# EAGLE design sensors (EAGLE 7.7.0)
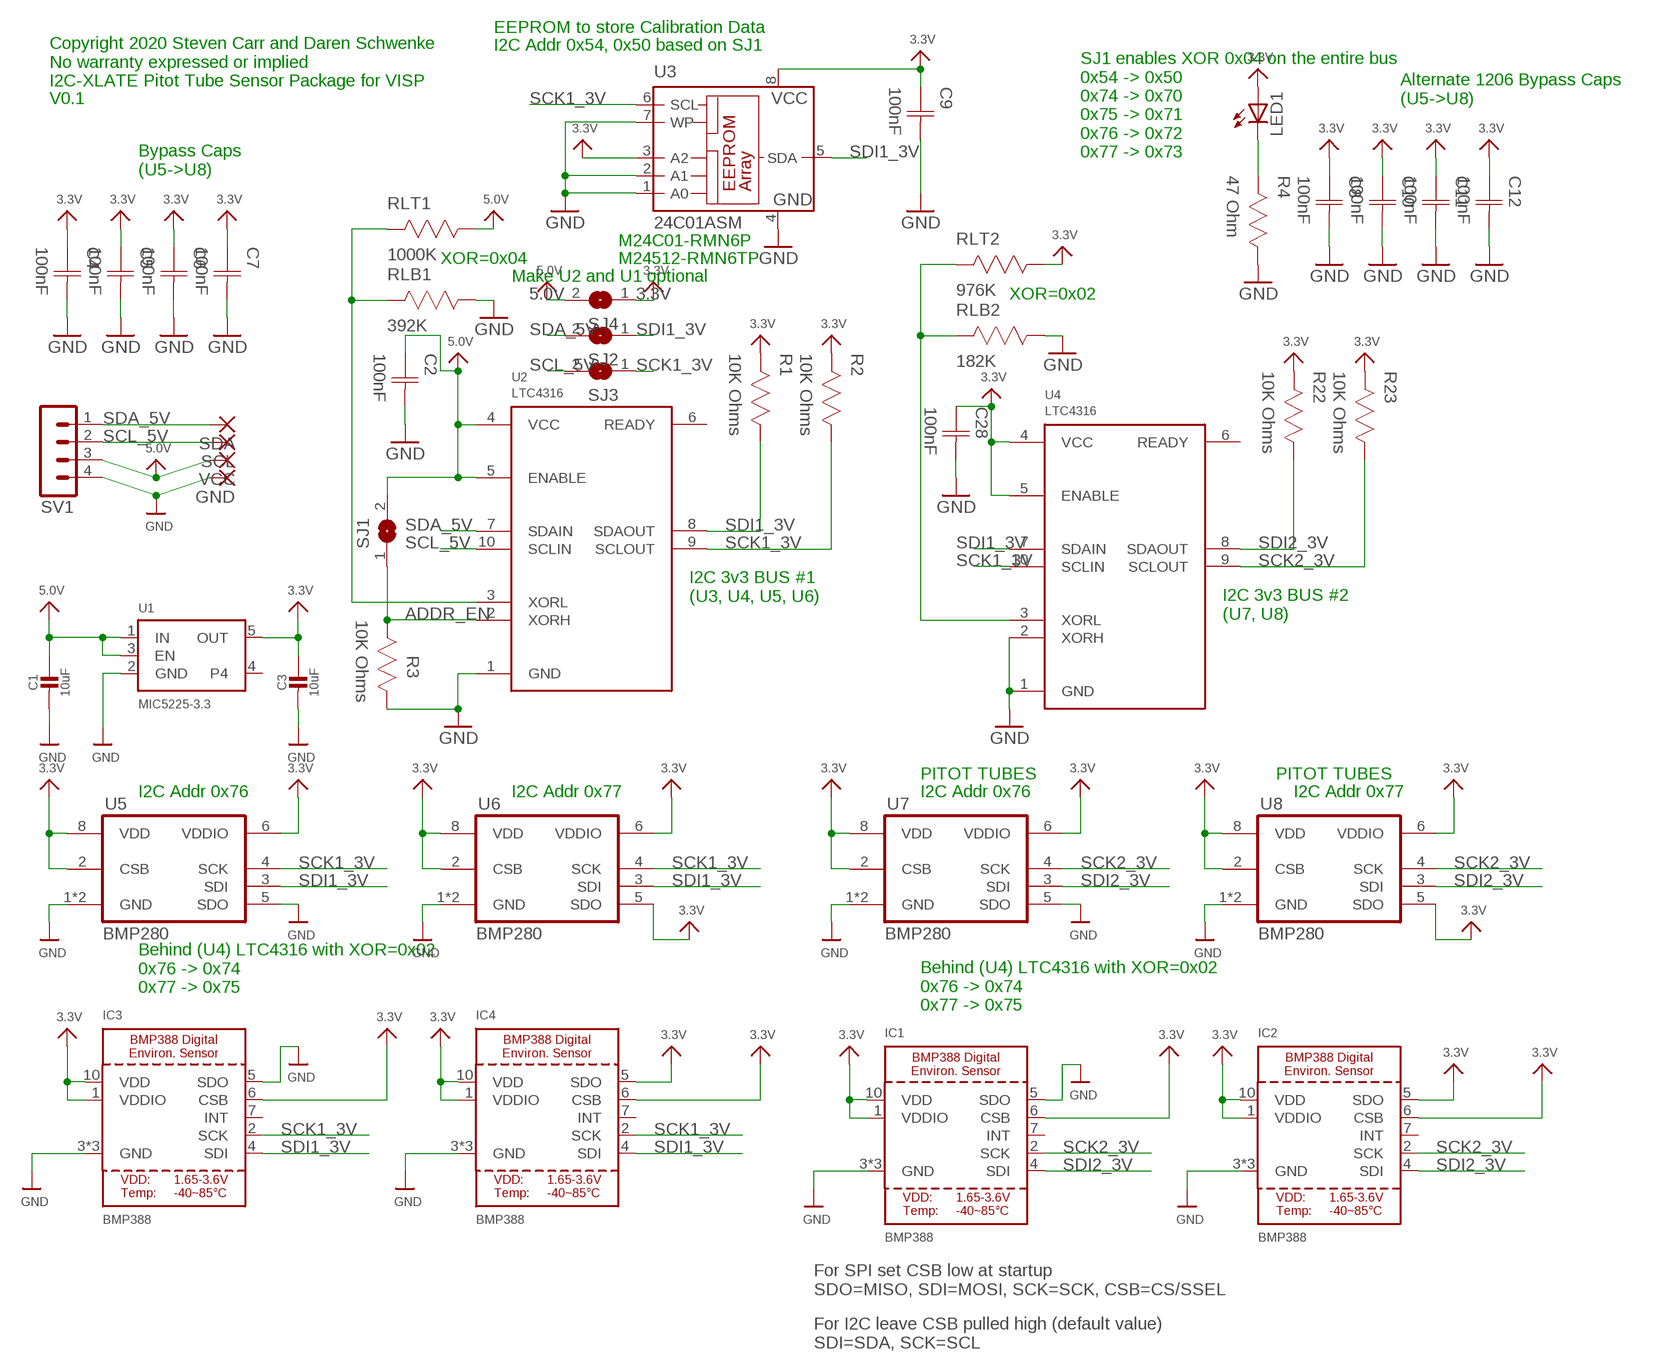
[diagram p0: schematic, sheet 1]

## Parts
C1  10uF  CAP_CERAMIC0603_NO  [0603-NO]
C2  100nF  CAPACITOR-0603  [CAP0603]
C3  10uF  CAP_CERAMIC0603_NO  [0603-NO]
C4  100nF  CAPACITOR-0402  [CAP0402]
C5  100nF  CAPACITOR-0402  [CAP0402]
C6  100nF  CAPACITOR-0402  [CAP0402]
C7  100nF  CAPACITOR-0402  [CAP0402]
C8  100nF  CAPACITOR-1206  [CAP1206]
C9  100nF  CAPACITOR-0603  [CAP0603]
C10  100nF  CAPACITOR-1206  [CAP1206]
C11  100nF  CAPACITOR-1206  [CAP1206]
C12  100nF  CAPACITOR-1206  [CAP1206]
C28  100nF  CAPACITOR-0603  [CAP0603]
GND  SMD2  [SMD1,27-2,54]
IC1  BMP388  [BMP388]
IC2  BMP388  [BMP388]
IC3  BMP388  [BMP388]
IC4  BMP388  [BMP388]
LED1  LEDCHIP-LED0603  [CHIP-LED0603]
R1  10K Ohms  RESISTOR-0603  [RES0603]
R2  10K Ohms  RESISTOR-0603  [RES0603]
R3  10K Ohms  RESISTOR-0603  [RES0603]
R4  47 Ohm  RESISTOR-0603  [RES0603]
R22  10K Ohms  RESISTOR-0603  [RES0603]
R23  10K Ohms  RESISTOR-0603  [RES0603]
RLB1  392K  RESISTOR-0603  [RES0603]
RLB2  182K  RESISTOR-0603  [RES0603]
RLT1  1000K  RESISTOR-0603  [RES0603]
RLT2  976K  RESISTOR-0603  [RES0603]
SCL  SMD2  [SMD1,27-2,54]
SDA  SMD2  [SMD1,27-2,54]
SJ1  SJ  [SJ]
SJ2  SJ  [SJ]
SJ3  SJ  [SJ]
SJ4  SJ  [SJ]
SV1  MA04-1  [MA04-1]
U1  MIC5225-3.3  VREG_SOT23-5  [SOT23-5]
U2  LTC4316  [MSOP10]
U3  24C01ASM  [SO-08M]
U4  LTC4316  [MSOP10]
U5  BMP280  [BMP280]
U6  BMP280  [BMP280]
U7  BMP280  [BMP280]
U8  BMP280  [BMP280]
VCC  SMD2  [SMD1,27-2,54]

## Nets
3.3V: C3.1 C4.1(C1) C5.1(C1) C6.1(C1) C7.1(C1) C8.1(C1) C9.1(C1) C10.1(C1) C11.1(C1) C12.1(C1) C28.1(C1) IC1.1(VDDIO) IC1.6(CSB) IC1.10(VDD) IC2.1(VDDIO) IC2.5(SDO) IC2.6(CSB) IC2.10(VDD) IC3.1(VDDIO) IC3.6(CSB) IC3.10(VDD) IC4.1(VDDIO) IC4.5(SDO) IC4.6(CSB) IC4.10(VDD) LED1.A R1.2 R2.2 R22.2 R23.2 RLT2.1 SJ4.1 U1.5(OUT) U3.3(A2) U3.8(VCC) U4.4(VCC) U4.5(ENABLE) U5.2(CSB) U5.6(VDDIO) U5.8(VDD) U6.2(CSB) U6.5(SDO) U6.6(VDDIO) U6.8(VDD) U7.2(CSB) U7.6(VDDIO) U7.8(VDD) U8.2(CSB) U8.5(SDO) U8.6(VDDIO) U8.8(VDD)
5.0V: C1.1 C2.1(C1) RLT1.1 SJ1.2 SJ4.2 SV1.3 U1.1(IN) U1.3(EN) U2.4(VCC) U2.5(ENABLE) VCC.1(P)
ADDR_EN: R3.2 SJ1.1 U2.2(XORH)
GND: C1.2 C2.2(C2) C3.2 C4.2(C2) C5.2(C2) C6.2(C2) C7.2(C2) C8.2(C2) C9.2(C2) C10.2(C2) C11.2(C2) C12.2(C2) C28.2(C2) GND.1(P) IC1.3(GND) IC1.5(SDO) IC1.8(GND) IC1.9(GND) IC2.3(GND) IC2.8(GND) IC2.9(GND) IC3.3(GND) IC3.5(SDO) IC3.8(GND) IC3.9(GND) IC4.3(GND) IC4.8(GND) IC4.9(GND) R3.1 R4.1 RLB1.1 RLB2.1 SV1.4 U1.2(GND) U2.1(GND) U3.1(A0) U3.2(A1) U3.4(GND) U3.7(WP) U4.1(GND) U4.2(XORH) U5.1(GND) U5.5(SDO) U5.7(GND) U6.1(GND) U6.7(GND) U7.1(GND) U7.5(SDO) U7.7(GND) U8.1(GND) U8.7(GND)
LED: LED1.C R4.2
SCK1_3V: IC3.2(SCK) IC4.2(SCK) R2.1 SJ3.1 U2.9(SCLOUT) U3.6(SCL) U4.10(SCLIN) U5.4(SCK) U6.4(SCK)
SCK2_3V: IC1.2(SCK) IC2.2(SCK) R23.1 U4.9(SCLOUT) U7.4(SCK) U8.4(SCK)
SCL_5V: SCL.1(P) SJ3.2 SV1.2 U2.10(SCLIN)
SDA_5V: SDA.1(P) SJ2.2 SV1.1 U2.7(SDAIN)
SDI1_3V: IC3.4(SDI) IC4.4(SDI) R1.1 SJ2.1 U2.8(SDAOUT) U3.5(SDA) U4.7(SDAIN) U5.3(SDI) U6.3(SDI)
SDI2_3V: IC1.4(SDI) IC2.4(SDI) R22.1 U4.8(SDAOUT) U7.3(SDI) U8.3(SDI)
XORL1: RLB1.2 RLT1.2 U2.3(XORL)
XORL2: RLB2.2 RLT2.2 U4.3(XORL)
Unconnected: IC1.7(INT) IC2.7(INT) IC3.7(INT) IC4.7(INT) U1.4 U2.6(READY) U4.6(READY)

## Notes on the sheet
- EEPROM to store Calibration Data
- I2C Addr 0x54, 0x50 based on SJ1
- Copyright 2020 Steven Carr and Daren Schwenke
  No warranty expressed or implied
  I2C-XLATE Pitot Tube Sensor Package for VISP
- V0.1
- Alternate 1206 Bypass Caps
  (U5->U8)
- SJ1 enables XOR 0x04 on the entire bus
  0x54 -> 0x50
  0x74 -> 0x70
  0x75 -> 0x71
  0x76 -> 0x72
  0x77 -> 0x73
- Bypass Caps
  (U5->U8)
- M24C01-RMN6P
- XOR=0x04 | M24512-RMN6TP
- Make U2 and U1 optional
- XOR=0x02
- I2C 3v3 BUS #1
  (U3, U4, U5, U6)
- I2C 3v3 BUS #2
  (U7, U8)
- PITOT TUBES | PITOT TUBES
- I2C Addr 0x76 | I2C Addr 0x77 | I2C Addr 0x76 | I2C Addr 0x77
- Behind (U4) LTC4316 with XOR=0x02
  0x76 -> 0x74
  0x77 -> 0x75
- Behind (U4) LTC4316 with XOR=0x02
  0x76 -> 0x74
  0x77 -> 0x75
- For SPI set CSB low at startup
  SDO=MISO, SDI=MOSI, SCK=SCK, CSB=CS/SSEL
- For I2C leave CSB pulled high (default value)
  SDI=SDA, SCK=SCL

## Library data of the parts
C1 C3 = microbuilder:CAP_CERAMIC: Ceramic Capacitors For new designs, use the packages preceded by an '_' character since they are more reliable: The following footprints should be used on most boards: _0402 - Standard footprint for regular board layouts _0603 - Standard footprint for regular board layouts _0805 - Standard footprint for regular board layouts _1206 - Standard footprint for regular board layouts For extremely tight-pitch boards where space is at a premium, the following 'micro-pitch' footprints can be used (smaller pads, no silkscreen outline, etc.): _0402MP - Micro-pitch footprint for very dense/compact boards _0603MP - Micro-pitch footprint for very dense/compact boards _0805MP - Micro-pitch footprint for very dense/compact boards _1206MP - Micro-pitch footprint for very dense/compact boards; MPN: C1608X5R1A106M080AC
C2 C9 C28 = Capacitor:CAPACITOR; MPN: CL10B104KB8NNNC
C4-C7 = Capacitor:CAPACITOR; MPN: CL10F104ZO8NNNC
C8 C10-C12 = Capacitor:CAPACITOR; MPN: C1206C104K5RAC7800
GND SCL SDA VCC = wirepad:SMD2: SMD PAD
IC1-IC4 = microbuilder:BMP388; MPN: BMP388
LED1 = led:LED: LED OSRAM: - CHIPLED LG R971, LG N971, LY N971, LG Q971, LY Q971, LO R971, LY R971 LH N974, LH R974 LS Q976, LO Q976, LY Q976 LO Q996 - Hyper CHIPLED LW Q18S LB Q993, LB Q99A, LB R99A - SideLED LS A670, LO A670, LY A670, LG A670, LP A670 LB A673, LV A673, LT A673, LW A673 LH A674 LY A675 LS A676, LA A676, LO A676, LY A676, LW A676 LS A679, LY A679, LG A679 - Hyper Micro SIDELED® LS Y876, LA Y876, LO Y876, LY Y876 LT Y87S - SmartLED LW L88C, LW L88S LB L89C, LB L89S, LG L890 LS L89K, LO L89K, LY L89K LS L896, LA L896, LO L896, LY L896 - TOPLED LS T670, LO T670, LY T670, LG T670, LP T670 LSG T670, LSP T670, LSY T670, LOP T670, LYG T670 LG T671, LOG T671, LSG T671 LB T673, LV T673, LT T673, LW T673 LH T674 LS T676, LA T676, LO T676, LY T676, LB T676, LH T676, LSB T676, LW T676 LB T67C, LV T67C, LT T67C, LS T67K, LO T67K, LY T67K, LW E67C LS E67B, LA E67B, LO E67B, LY E67B, LB E67C, LV E67C, LT E67C LW T67C LS T679, LY T679, LG T679 LS T770, LO T770, LY T770, LG T770, LP T770 LB T773, LV T773, LT T773, LW T773 LH T774 LS E675, LA E675, LY E675, LS T675 LS T776, LA T776, LO T776, LY T776, LB T776 LHGB T686 LT T68C, LB T68C - Hyper Mini TOPLED® LB M676 - Mini TOPLED Santana® LG M470 LS M47K, LO M47K, LY M47K Source: http://www.osram.convergy.de LUXEON: - LUMILED® LXK2-PW12-R00, LXK2-PW12-S00, LXK2-PW14-U00, LXK2-PW14-V00 LXK2-PM12-R00, LXK2-PM12-S00, LXK2-PM14-U00 LXK2-PE12-Q00, LXK2-PE12-R00, LXK2-PE12-S00, LXK2-PE14-T00, LXK2-PE14-U00 LXK2-PB12-K00, LXK2-PB12-L00, LXK2-PB12-M00, LXK2-PB14-N00, LXK2-PB14-P00, LXK2-PB14-Q00 LXK2-PR12-L00, LXK2-PR12-M00, LXK2-PR14-Q00, LXK2-PR14-R00 LXK2-PD12-Q00, LXK2-PD12-R00, LXK2-PD12-S00 LXK2-PH12-R00, LXK2-PH12-S00 LXK2-PL12-P00, LXK2-PL12-Q00, LXK2-PL12-R00 Source: www.luxeon.com KINGBRIGHT: KA-3528ASYC Source: www.kingbright.com; MPN: SML-D12P8WT86
R1 R2 R22 R23 RLT1 = Resistor:RESISTOR; MPN: CRCW060310K0FKEAC
R3 = Resistor:RESISTOR; MPN: CL10B104KB8NNNC
R4 = Resistor:RESISTOR; MPN: RC0603FR-0747RL
RLB1 = Resistor:RESISTOR; MPN: RC0603FR-07392KL
RLB2 = Resistor:RESISTOR; MPN: RC0603FR-07182KL
RLT2 = Resistor:RESISTOR; MPN: RC0603FR-07976KL
SJ1-SJ4 = jumper:SJ: SMD solder JUMPER
SV1 = con-lstb:MA04-1: PIN HEADER; OC_FARNELL: unknown; OC_NEWARK: unknown
U1 = microbuilder:VREG_SOT23-5: SOT23-5 Fixed Voltage Regulators Part Current Out V Out V In V Dropout θJA (°C/W) TJ (°C) Digikey Part No. ADP121 150mA 3.3V 3.4-5.5V 0.09V @ 150mA -- -- ADP121-AUJZ33R7CT-ND ADP121 150mA 3.0V 3.1-5.5V 0.09V @ 150mA -- -- ADP121-AUJZ30R7CT-ND ADP122 300mA 3.3V 3.4-5.5V 0.085V @ 300mA -- -- ADP122AUJZ-3.3-R7CT-ND ADP1712 300mA 3.3V 3.5-5.5V 0.17V @ 300mA -- -- ADP1712AUJZ-3.3-R7TR-ND AP7311 (Low Cost) 150mA 3.3V 3.5-6V 0.15V @ 150mA -- -- AP7311-33WG-7DICT-ND LD39015M18R 150mA 1.8V 1.9V-5.5V 0.08V @ 100mA -- -- 497-6977-1-ND LP2985A-33DBVR 150mA 3.3V 3.3-16V 0.28V @ 150mA 206 150 296-18479-1-ND MCP1824T-3302E/OT 300mA 3.3V 3.5V-6V 0.2V @ 300mA -- -- MCP1824T-3302E/OTCT-ND MIC5205-2.5YM5 TR 150mA 2.5V 2.7-16V 0.165V @ 150mA -- -- 576-1257-2-ND MIC5205-3.0YM5 TR 150mA 3.0V 3.2V-16V 0.165V @ 150mA -- -- 576-1258-2-ND MIC5205-3.3YM5 TR 150mA 3.3V 3.5V-16V 0.165V @ 150mA -- -- 576-1259-2-ND TPS780330220 150mA 3.3V+2.2V 3.6-5.5V 250mV Max -- -- 296-23332-1-ND TDA3663/N1,135 100mA 3.3V 3.5-45V 0.18V @ 50mA -- -- 568-5343-1-ND Max operating temp can be calculated using θJA, TJ (max junction temperature), and power in watts. Set the "Maximum Ambient Temperature" until it reaches TJ ("Max Junction Temperature"), which is the absolute limit for safe use of the regulator: Heat Sink Temperature Calculator <http://www.daycounter.com/Calculators/Heat-Sink-Temperature-Calculator.phtml> For example, With 12V source into a 3.3V LP2985 and a 30mA load, we are dissipating (12V-3.3V) * 0.03A = 0.261W. With a θJA of 206 °C/W, a TJ of 150°C, and 261mW we can safely use the chip without a heat sink up to 75°C (=147.1°C Junction Temperature).; MPN: MIC5225-3.3YM5-TR
U2 U4 = Analog Devices:LTC4316; MPN: LTC4316IMS#PBF
U3 = microchip:24*: Serial EEPROM I2C; MF: MICROCHIP; MPN: M24C01-RMN6P
U5-U8 = bosch-bmp280:BMP280: The BMP280 is an absolute barometric pressure sensor especially designed for mobile applications. The sensor module is housed in an extremely compact 8-pin metal-lid LGA package with a footprint of only 2.0 × 2.5 mm2 and 0.95 mm package height. Its small dimensions and its low power consumption of 2.7 μA @1Hz allow the implementation in battery driven devices such as mobile phones, GPS modules or watches. The library has been designed by Richard Magdycz <https://www.facebook.com/groups/eaglecadsoftUK>; MPN: BMP280

## Board
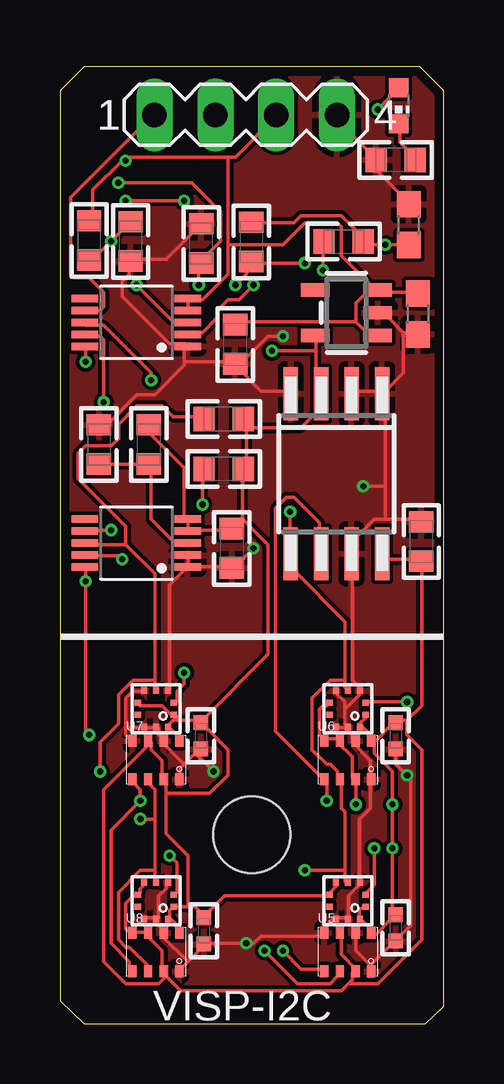
[diagram p1: board, top side]
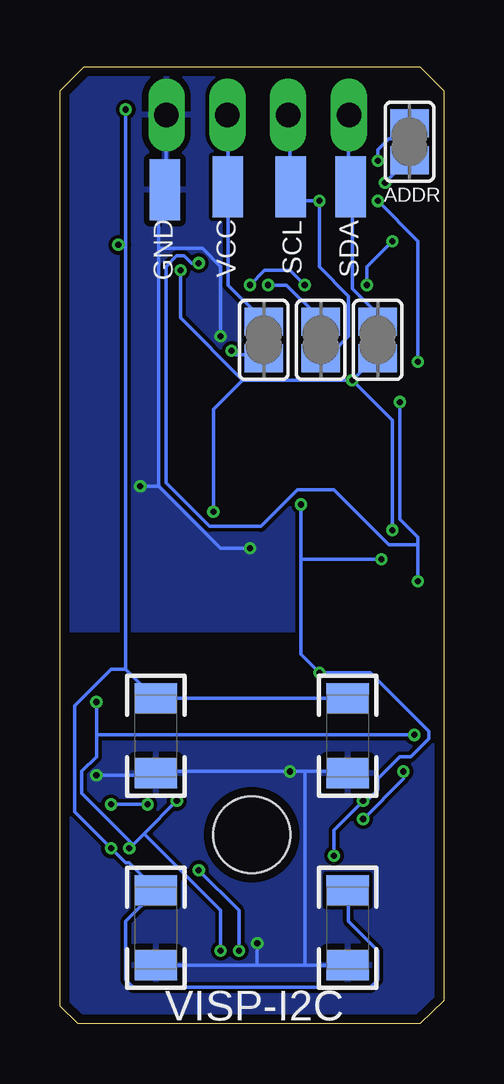
[diagram p2: board, bottom side, seen from below]

Size 16 x 39.88 mm. Coordinates in mm from the lower left corner, seen from the top.
Outline: 1,39.88 0,38.88 0,0.95 1,0 15.23,0 16,0.72 16,38.88 15,39.88 1,39.88
Copper layers (1*16): Top 0.035559375mm / dielectric 1.6mm / Bottom 0.035559375mm
Design rules "oshpark-2layer": minimum track width 6mil, minimum drill 10mil, track to track 6mil, track to pad 6mil, pad to pad 6mil, via to via 6mil, smd to smd 6mil, copper to edge 15mil, drill to drill 6mil, minimum pad ring 5mil, minimum via ring 5mil, stop-mask expansion 2.5mil, vias tented up to drill 0mil, thermal gap 10mil
Holes 3.2 mm at 8,7.88
vRestrict: area 2.8,2.8 to 5.2,5.2; area 10.8,2.8 to 13.2,5.2; area 2.8,10.8 to 5.2,13.2; area 10.8,10.8 to 13.2,13.2

### Footprints (pad centres in the part's own frame; a part is rotated, then mirrored left to right if it is on the bottom)
0603-NO = smd 1.1 x 1: 1 -0.85,0; 2 0.85,0
CAP0603 = smd 0.889 x 1.016: 1 -0.819,0; 2 0.819,0
CAP0402 = smd 0.6 x 0.6: 1 -0.55,0; 2 0.55,0
CAP1206 = smd 1.27 x 1.778: 1 -1.549,0; 2 1.549,0
SMD1,27-2,54 = smd 1.27 x 2.54: 1 0,0
BMP388 = smd 0.25 x 0.275: 1 0.25,0.75; 2 -0.25,0.75; 6 -0.25,-0.75; 7 0.25,-0.75 | smd 0.275 x 0.25: 3 -0.762,0.5; 4 -0.762,0; 5 -0.762,-0.5; 8 0.762,-0.5; 9 0.762,0; 10 0.762,0.5
CHIP-LED0603 = smd 0.8 x 0.8: A 0,-0.75; C 0,0.75
RES0603 = smd 0.889 x 1.016: 1 -0.819,0; 2 0.819,0
SJ = smd 1.168 x 1.6: 1 -0.762,0; 2 0.762,0
MA04-1 = drill 1.016 long: 1 -3.81,0; 2 -1.27,0; 3 1.27,0; 4 3.81,0
SOT23-5 = smd 0.55 x 1.2: 1 -0.95,-1.3; 2 0,-1.3; 3 0.95,-1.3; 4 0.95,1.3; 5 -0.95,1.3
MSOP10 = smd 0.3 x 1.1: 1 -1,-2.14; 2 -0.5,-2.14; 3 0,-2.14; 4 0.5,-2.14; 5 1,-2.14; 6 1,2.14; 7 0.5,2.14; 8 0,2.14; 9 -0.5,2.14; 10 -1,2.14
SO-08M = smd 0.6 x 2.2: 1 -1.905,-3.33; 2 -0.635,-3.33; 3 0.635,-3.33; 4 1.905,-3.33; 5 1.905,3.33; 6 0.635,3.33; 7 -0.635,3.33; 8 -1.905,3.33
BMP280 = smd 0.35 x 0.5: 1 0.975,-0.8; 2 0.325,-0.8; 3 -0.325,-0.8; 4 -0.975,-0.8; 5 -0.975,0.8; 6 -0.325,0.8; 7 0.325,0.8; 8 0.975,0.8

### Placement (x,y rotation side)
C1  14.93,29.57 270 top
C2  7.31,28.32 270 top
C3  14.54,33.3 90 top
C4  5.88,12 270 top
C5  14,4 270 top
C6  6,3.88 270 top
C7  14,12 270 top
C8  4,4 270 bottom
C9  15.07,20.09 90 top
C10  4,12 270 bottom
C11  12,4 270 bottom
C12  12,12 270 bottom
C28  7.17,19.82 270 top
GND  11.62,34.75 0 bottom
IC1  4,13.12 270 top
IC2  4,5.12 270 top
IC3  12,13.12 270 top
IC4  12,5.12 270 top
LED1  14.12,38.25 180 top
R1  11.83,32.59 0 top
R2  7.99,32.58 90 top
R3  5.89,32.52 270 top
R4  14,36 0 top
R22  6.83,25.2 0 top
R23  6.83,23.12 0 top
RLB1  2.95,32.6 90 top
RLB2  1.63,24.14 270 top
RLT1  1.22,32.65 270 top
RLT2  3.71,24.14 270 top
SCL  6.38,34.88 0 bottom
SDA  3.88,34.88 0 bottom
SJ1  1.42,36.76 90 bottom
SJ2  2.75,28.5 90 bottom
SJ3  5.12,28.5 270 bottom
SJ4  7.5,28.5 90 bottom
SV1  7.75,37.88 0 top
U1  11.95,29.63 90 top
U2  3.19,29.23 90 top
U3  11.53,22.92 180 top
U4  3.19,20.04 90 top
U5  12,3 0 top
U6  12,11 0 top
U7  4,11 0 top
U8  4,3 0 top
VCC  9,34.88 0 bottom

### Tracks (layer width: path | path; a pad name or v marks a point on that pad's centre or on a via)
3.3V  (via drill 0.25)
  Top 0.152: U3.8 13.56,19.51 13.72,19.36 14.94,19.36 C9.1 15.09,19.2 15.09,13.26 14.48,12.65 | IC3.6 11.12,13.26 10.97,13.26 10.82,13.11 10.82,12.04 10.97,11.89 U6.5 11.12,11.89 11.58,11.89 U6.6 11.58,11.73 12.19,11.12 12.19,10.21 U6.2 12.34,10.06 v12.34,9.14 | 12.5,4.42 12.5,4.72 12.65,4.88 IC4.1 | 12.5,4.42 12.95,3.96 12.95,3.81 U5.8 13.11,3.66 13.87,4.42 C5.1 13.87,4.57 v13.87,7.32 v13.87,9.14 13.87,10.52 13.11,11.28 13.11,11.73 | 12.5,4.42 IC4.10 | 12.5,12.5 12.8,12.8 IC3.1 | 12.5,12.5 12.95,12.04 12.95,11.89 U6.8 13.11,11.73 | 12.5,12.5 IC3.10 | 13.11,11.73 13.87,12.5 C7.1 14.02,12.65 14.48,12.65 | 10.67,28.04 10.67,26.52 10.82,26.36 U3.3 10.82,26.21 10.82,25.6 10.06,24.84 7.77,24.84 | 10.67,28.04 10.67,28.65 U1.5 | 10.67,28.04 v8.84,28.04 | 7.77,24.84 7.77,25.15 R22.2 7.77,24.84 | 7.77,24.84 7.77,23.16 R23.2 7.62,23.01 7.62,21.03 | 5.33,20.57 7.16,20.57 C28.1 | RLT2.1 3.81,24.84 3.81,24.54 5.18,23.16 5.18,21.18 U4.5 5.33,20.57 | 5.33,20.57 U4.4 | 7.62,21.03 7.32,20.73 C28.1 | U5.6 11.73,3.66 11.73,2.9 12.34,2.29 U5.2 12.19,2.13 12.19,1.83 12.04,1.68 | IC2.5 3.5,5.79 3.35,5.64 3.35,5.49 IC2.6 3.2,5.33 3.05,5.33 2.74,5.03 2.74,3.96 2.9,3.81 U8.5 3.05,3.81 3.66,3.81 U8.6 3.66,3.66 4.27,3.05 4.27,2.29 U8.2 | 12.04,1.68 11.73,1.37 5.03,1.37 4.42,1.98 | 4.42,1.98 4.27,2.13 U8.2 | 4.72,12.65 4.88,12.8 IC1.1 4.72,12.8 4.27,13.26 3.35,13.26 IC1.6 | 4.72,12.65 4.57,12.5 IC1.10 4.57,12.34 4.88,12.04 4.88,11.89 U7.8 | 4.72,12.65 5.79,12.65 C4.1 | 3.81,11.73 3.81,11.43 4.27,10.97 4.27,10.21 U7.2 4.42,10.06 4.42,9.6 | 4.57,4.42 4.57,4.72 4.72,4.88 IC2.1 4.88,4.88 5.33,4.88
  Top 0.152: 4.57,4.42 4.88,4.12 4.88,3.81 U8.8 | 4.57,4.42 IC2.10 | IC4.5 11.58,5.79 11.28,5.49 IC4.6 11.12,5.33 6.86,5.33 6.1,4.57 C6.1 5.94,4.57 5.64,4.88 5.33,4.88 | 4.42,9.6 4.42,7.92 5.33,7.01 5.33,4.88 | 4.42,9.6 6.25,9.6 7.01,10.36 7.01,11.43 5.94,12.5 C4.1 | 4.42,1.98 4.12,1.68 2.74,1.68 1.83,2.59 1.83,9.75 3.81,11.73 | 4.42,1.98 U8.2 | 3.81,11.73 U7.6 | 7.62,21.03 8.69,19.96 8.69,15.39 5.94,12.65 C4.1 | 7.62,21.03 C28.1 | 14.48,12.65 14.48,12.04 15.09,11.43 15.09,3.5 13.26,1.68 12.04,1.68 | C3.1 14.48,32.46 v13.56,32.46 12.65,32.46 R1.2 12.5,32.61 12.5,32.92 11.73,33.68 10.06,33.68 9.75,33.38 7.92,33.38 R2.2 | v13.26,38.1 14.02,38.86 LED1.A
  Bottom 0.152: v13.87,9.14 v12.34,9.14 | v8.84,28.04 8.69,27.89 7.62,27.89 SJ4.1 | C8.1 3.96,5.49 3.96,4.27 2.74,3.05 2.74,1.83 3.05,1.52 12.95,1.52 13.26,1.83 13.26,4.27 12.04,5.49 C11.1 12.04,5.64 13.11,6.71 13.26,6.71 v13.87,7.32 15.39,8.84 15.39,13.26 13.87,14.78 13.26,14.78 | 13.26,14.78 13.26,32.46 | 13.26,32.46 v13.26,38.1 | 13.26,14.78 12.04,13.56 C12.1 11.89,13.56 4.12,13.56 C10.1 | 13.26,32.46 v13.56,32.46
5.0V  (via drill 0.25)
  Top 0.152: C1.1 14.78,30.48 13.26,30.48 U1.3 | 12.34,29.26 7.32,29.26 C2.1 | 12.34,29.26 12.8,28.8 13.11,28.8 U1.1 | 12.34,29.26 12.34,30.02 12.8,30.48 13.11,30.48 U1.3 | 5.33,30.18 5.33,29.87 U2.4 | 2.59,35.97 2.74,36.12 7.01,36.12 | 2.59,35.97 1.37,34.75 1.37,33.53 RLT1.1 | 7.01,36.12 7.32,36.12 8.99,37.8 SV1.3 | 5.33,30.18 5.94,30.18 7.01,31.24 7.01,32.46 | 7.01,36.12 7.01,32.46 | 5.33,30.18 U2.5 | 2.59,35.97 v2.74,35.97 | 7.01,32.46 9.3,32.46 10.21,33.38 11.58,33.38 11.73,33.22 11.73,32 13.11,30.63 U1.3
  Bottom 0.152: SJ4.2 7.62,29.41 8.99,30.79 8.99,34.75 VCC.1 8.99,34.9 8.99,37.8 SV1.3 | v2.74,35.97 2.74,36.42 2.29,36.88 2.13,36.88 1.52,37.49 SJ1.2
ADDR_EN  (via drill 0.25)
  Top 0.152: v2.44,35.05 5.49,35.05 6.71,33.83 6.71,32.61 5.94,31.85 R3.2 5.79,31.7 v5.79,30.79 | v8.08,30.79 7.47,30.18 7.01,30.18 6.55,29.72 6.55,29.41 5.94,28.8 5.33,28.8 U2.2
  Bottom 0.152: v2.44,35.05 1.52,35.97 SJ1.1 | v8.08,30.79 7.47,31.39 6.4,31.39 v5.79,30.79
GND  (via drill 0.25)
  Top 0.152: R3.1 5.79,33.22 4.42,31.85 3.05,31.85 RLB1.1 2.9,31.7 2.9,31.24 2.59,30.94 2.59,30.33 4.57,28.35 5.18,28.35 U2.1 5.18,28.19 5.18,27.58 | 5.18,27.58 5.18,27.43 3.96,26.21 3.2,26.21 1.98,24.99 1.68,24.99 RLB2.1 | 5.18,27.58 7.16,27.58 C2.2 | U3.4 9.6,26.36 8.38,26.36 7.32,27.43 C2.2 | IC1.3 4.57,14.02 4.57,18.29 5.18,18.9 U4.1 | U4.1 7.16,19.05 C28.2 7.32,19.05 v8.08,19.81 | U4.1 5.33,19.51 U4.2 | C3.2 14.48,34.29 13.26,35.51 13.26,35.97 R4.1 13.11,36.12 11.43,37.8 SV1.4 | v9.3,28.65 8.69,28.65 7.62,27.58 7.32,27.58 C2.2 | 12.95,2.44 13.11,2.29 U5.1 12.95,2.44 | 12.95,2.44 12.34,3.05 12.34,3.66 U5.7 | 12.95,2.44 13.87,3.35 C5.2 14.02,3.5 14.63,4.12 14.63,10.21 v14.48,10.36 14.02,10.82 14.02,11.43 C7.2 | 5.64,11.28 5.79,11.43 C4.2 5.64,11.28 | 5.64,11.28 5.18,10.82 | 5.18,10.82 5.03,10.67 5.03,10.21 U7.1 | 3.5,12.34 3.96,12.34 IC1.9 4.12,12.34 4.12,12.04 4.27,11.89 U7.7 4.27,11.73 5.18,10.82 | 2.74,12.34 2.74,12.04 2.9,11.89 U7.5 | 2.74,12.34 2.74,13.56 3.05,13.87 3.5,13.87 IC1.5 | 2.74,12.34 3.5,12.34 | 3.5,12.34 IC1.8 | v6.4,10.52 5.64,11.28 | 13.56,21.03 13.11,21.03 12.19,20.12 12.19,19.66 U3.7 12.19,19.51 12.19,14.33 12.5,14.02 IC3.3 12.5,13.87 12.5,13.72 11.89,13.11 | 13.56,21.03 14.94,21.03 C9.2 | 14.33,28.8 14.78,28.8 C1.2 | 14.33,28.8 13.56,29.57 13.26,29.57 U1.2 | 14.33,28.8 14.33,27.13 13.56,26.36 U3.1 | U3.2 12.19,26.36 13.41,26.36 U3.1 | 13.56,22.4 13.56,26.21 U3.1 | 13.56,22.4 13.56,21.03 | 5.33,2.59 5.94,3.2 C6.2 6.1,3.35 v7.77,3.35 8.08,3.35 8.38,3.66 10.97,3.66 U5.5 11.12,3.81 11.12,4.12 11.43,4.42 IC4.8 11.58,4.42 11.89,4.42 IC4.9 12.04,4.42 12.04,5.33 12.5,5.79 IC4.3 12.5,5.94 12.5,8.53 12.95,8.99 12.95,10.06 U6.1 12.95,10.21 12.95,10.97 12.19,11.73 U6.7 12.19,11.89 12.19,12.04 11.89,12.34
  Top 0.152: 5.33,2.59 5.03,2.29 U8.1 | IC2.8 3.5,4.42 3.96,4.42 IC2.9 | IC2.3 4.42,5.79 4.42,5.64 4.12,5.33 4.12,4.42 IC2.9 | IC2.9 3.96,4.27 4.27,3.96 4.27,3.81 U8.7 4.27,3.66 5.33,2.59 | 11.89,12.34 11.58,12.34 IC3.8 | 11.89,13.11 11.89,12.5 IC3.9 11.89,12.34 | 11.89,13.11 11.89,13.41 11.58,13.72 11.58,13.87 IC3.5 | 13.56,22.4 v12.65,22.4
  Bottom 0.152: SV1.4 11.58,37.8 11.58,34.9 GND.1 11.73,34.75 11.89,34.59 11.89,32.31 | v8.08,19.81 9.3,19.81 11.89,22.4 | 11.89,32.31 11.89,22.4 | v9.3,28.65 9.3,31.55 10.06,32.31 11.89,32.31 | 7.77,2.44 11.89,2.44 C11.2 | 7.77,2.44 5.79,2.44 | 5.79,2.44 4.12,2.44 C8.2 | 5.79,10.52 v6.4,10.52 11.89,10.52 C12.2 12.04,10.36 v14.48,10.36 | 5.79,10.52 4.12,10.52 C10.2 | 5.79,10.52 5.79,2.44 | v7.77,3.35 7.77,2.44 | v12.65,22.4 11.89,22.4
  pour Bottom: 0,38.88 0.88,39.75 15,39.75 16,38.75 16,16.38 0,16.38
  pour Top: 0,38.88 0.88,39.75 15.12,39.75 16,38.88 16,16.25 0,16.25
  pour Top: 0,16 16,16 16,0.88 15.12,0 1.12,0 0,1.12
  pour Bottom: 0,16 16,16 16,0.88 15.12,0 1.12,0 0,1.12
LED
  Top 0.152: LED1.C 14.17,37.49 14.17,36.73 14.78,36.12 R4.2
SCK1_3V  (via drill 0.25)
  Top 0.152: v7.32,30.79 7.77,31.24 7.77,31.55 R2.1 7.92,31.7 v10.21,31.7 | v13.11,7.32 13.11,5.79 12.8,5.49 IC4.2 | v11.12,9.3 11.12,10.06 U6.4 10.97,10.21 8.99,12.19 8.99,21.49 9.45,21.95 9.75,21.95 10.82,20.88 10.82,19.66 U3.6 | v14.48,13.41 12.8,13.41 IC3.2 | v9.3,3.05 10.06,2.29 10.97,2.29 U5.4 | v1.22,12.04 1.07,12.19 v1.07,18.44 1.07,18.9 U4.10 | v1.83,25.91 1.83,28.5 1.68,28.65 1.07,28.65 U2.9
  Bottom 0.152: v7.32,30.79 6.55,30.79 5.18,29.41 SJ3.1 | v11.12,9.3 12.5,7.92 | 12.5,7.92 12.95,7.47 | 14.48,12.04 14.48,11.12 15.09,10.52 15.09,9.6 12.95,7.47 | 14.48,12.04 v14.48,13.41 | 12.95,7.47 v13.11,7.32 | v9.3,3.05 9.3,4.72 12.5,7.92 | 14.48,12.04 v1.22,12.04 | v1.83,25.91 1.83,21.03 1.07,20.27 1.07,19.96 | v1.07,18.44 1.07,19.96 | v10.21,31.7 10.52,31.7 10.82,32 11.12,32 11.58,31.55 11.58,22.55 9.75,20.73 7.62,20.73 6.1,22.25 4.57,22.25 2.29,19.96 1.07,19.96
SCK2_3V  (via drill 0.25)
  Top 0.152: v4.57,7.01 4.88,6.71 4.88,5.49 IC2.2 | U7.4 3.05,10.06 3.35,9.75 v3.35,9.3 2.13,8.08 2.13,3.35 2.9,2.59 2.9,2.29 U8.4 | v5.18,14.63 5.18,14.17 4.88,13.87 4.88,13.41 IC1.2 | v5.94,21.64 5.94,23.01 R23.1 | v2.59,19.36 2.44,19.51 1.07,19.51 U4.9
  Bottom 0.152: v4.57,7.01 4.57,8.08 v3.35,9.3 3.2,9.3 2.74,9.75 2.74,10.21 1.83,11.12 1.37,11.12 0.61,11.89 0.61,12.19 3.05,14.63 v5.18,14.63 5.94,15.39 5.94,19.36 | 5.94,19.36 v5.94,21.64 | 5.94,19.36 v2.59,19.36
SCL_5V  (via drill 0.25)
  Top 0.152: v1.07,27.58 1.07,28.19 U2.10 | v5.18,34.29 v2.74,34.29
  Bottom 0.152: v1.07,27.58 1.07,32.61 v2.74,34.29 | SJ3.2 5.03,27.89 4.72,27.89 3.96,28.65 3.96,30.33 5.18,31.55 v5.18,34.29 5.79,34.29 6.25,34.75 SCL.1 6.4,34.9 6.4,37.8 SV1.2
SDA_5V
  Top 0.152: U2.7 1.07,29.72 1.68,29.72 1.83,29.87 1.83,30.48 1.22,31.09 0.61,31.09 0.46,31.24 0.46,34.44 3.81,37.8 SV1.1
  Bottom 0.152: SJ2.2 2.9,29.41 2.9,29.72 3.81,30.63 3.81,34.75 SDA.1 3.96,34.9 3.96,37.8 SV1.1
SDI1_3V  (via drill 0.25)
  Top 0.152: 11.89,14.33 11.89,16.76 9.75,18.9 9.75,19.51 U3.5 9.6,19.66 v9.6,21.34 | 11.89,14.33 11.89,14.02 IC3.4 | 11.89,6.4 11.89,8.84 11.73,8.99 11.73,10.06 U6.3 11.58,10.21 11.58,10.52 11.28,10.82 11.12,10.82 10.52,11.43 10.52,13.56 11.28,14.33 11.89,14.33 | 11.89,6.4 11.89,5.94 IC4.4 | v8.53,3.05 9.91,1.68 11.28,1.68 11.58,1.98 11.58,2.13 U5.3 | 11.89,6.4 v10.21,6.4 | v10.97,31.39 10.97,32.46 R1.1 | v2.13,20.57 1.07,20.57 U4.7 | v3.81,26.82 3.81,27.13 1.83,29.11 1.07,29.11 U2.8
  Bottom 0.152: v8.53,3.05 8.53,4.72 v10.21,6.4 | v10.97,31.39 10.97,29.41 8.38,26.82 | v3.81,26.82 8.38,26.82 | v3.81,26.82 2.9,27.74 SJ2.1 | v2.13,20.57 2.13,25.15 v3.81,26.82 | v9.6,21.34 9.6,25.6 8.38,26.82
SDI2_3V  (via drill 0.25)
  Top 0.152: 3.96,8.53 3.96,9.75 3.66,10.06 U7.3 | 3.96,8.53 3.96,6.4 | 3.96,6.4 3.96,5.94 IC2.4 | 3.96,6.4 3.35,6.4 2.44,5.49 2.44,3.5 2.74,3.2 2.9,3.2 3.66,2.44 3.66,2.29 U8.3 | 3.96,14.33 3.96,18.75 2.74,19.96 | 3.96,14.33 3.96,14.02 IC1.4 | 2.74,19.96 1.07,19.96 U4.8 | 2.74,19.96 2.74,20.73 0.76,22.71 0.76,23.77 1.07,24.08 2.13,24.08 2.44,24.38 2.44,24.99 3.2,25.76 4.27,25.76 4.72,25.3 5.94,25.3 R22.1 | v3.35,8.53 3.96,8.53 | v1.68,10.52 1.68,11.73 2.44,12.5 2.44,13.72 3.05,14.33 3.96,14.33
  Bottom 0.152: v3.35,8.53 1.68,10.21 v1.68,10.52
XORL1  (via drill 0.25)
  Top 0.152: RLT1.2 1.37,31.85 v2.13,32.61 2.9,33.38 RLB1.2 | v3.2,30.79 4.72,29.26 5.18,29.26 U2.3
  Bottom 0.152: v3.2,30.79 3.2,31.55 v2.13,32.61
XORL2
  Top 0.152: RLB2.2 1.68,23.32 3.66,23.32 RLT2.2 3.81,23.32 3.81,21.03 4.72,20.12 5.18,20.12 U4.3

### Text on the board
tNames: VISP-I2C
bNames: ADDR | VISP-I2C
tValues: -I<I- | XOR1 | 10k | 10k | 10k | 10uF | 1000K | 392K | 10uF | XOR2 | 10k | 182K | 10k | 976K | (c) 2020 Steven Carr / & Daren Schwenke
bValues: 3V3 | I2C | BYPASS | ADDR Selection / open | closed = chip I2C Addr / 0x54 | 0x50 = EEPROM / 0x74 | 0x70 = U7 / 0x75 | 0x71 = U8 / 0x76 | 0x72 = U5 / 0x77 | 0x73 = U6 / / (c) 2020 Steven Carr / & Daren Schwenke